# Altium schematic sheet knobs.SchDoc
size A3
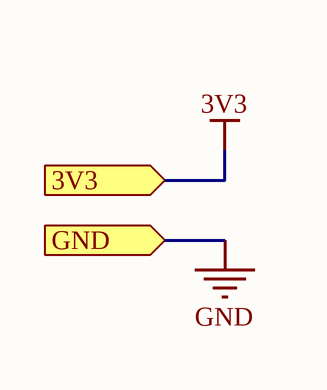
[diagram p0: knobs.SchDoc]

## Ports
3V3 (in), GND (in)

## Nets
3V3: port 3V3
GND: port GND